# Altium schematic sheet POWER.SchDoc
size A4; SheetNumber: 4; SheetTotal: 4
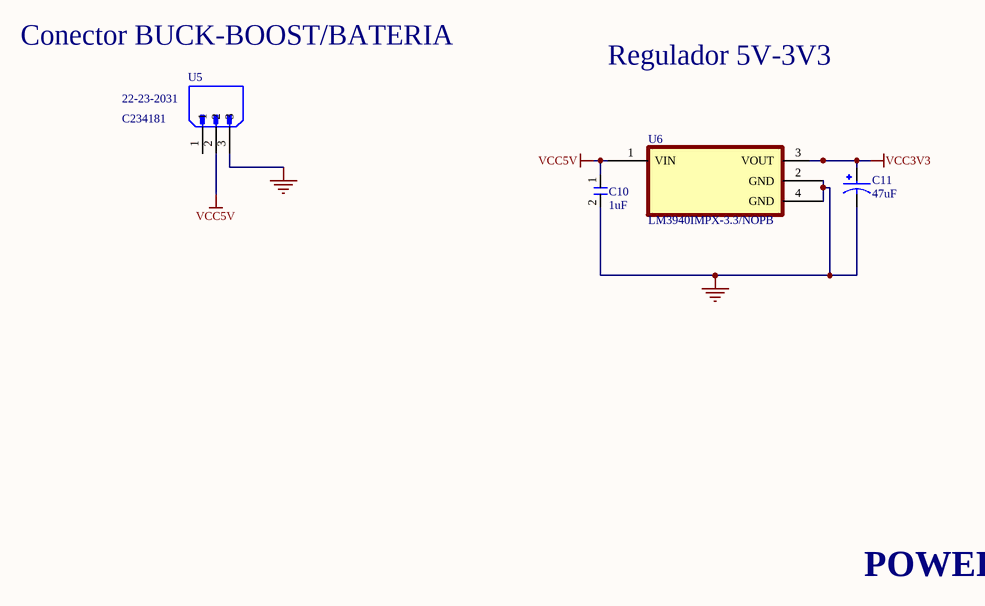
[diagram p0: POWER.SchDoc]

## Parts
C10  1uF  [0805_samsung]
C11  47uF  [47uF]
U5  22-23-2031  LCSC: C234181  [conector3pinos]
U6  LM3940IMPX-3.3/NOPB  [regulador]

## Nets
GND: C10.2 C11.2 U5.3 U6.2(GND) U6.4(GND)
VCC3V3: C11.1 U6.3(VOUT)
VCC5V: C10.1 U5.2 U6.1(VIN)

Not connected (* = marked no-connect by the designer): U5 1

## Notes on the sheet
- Conector BUCK-BOOST/BATERIA
- Regulador 5V-3V3
- POWER

## Library data of the parts
C10 = CL21B105KBFNNNE: 50V 1uF X7R ±10% 0805 Multilayer Ceramic Capacitors MLCC - SMD/SMT ROHS; Manufacturer: Samsung Electro-Mechanics; Value: 1µF; Supplier: Avnet; Supplier Part Number: CL21B105KBFNNNE; Manufacturer Part Number: CL21B105KBFNNNE; RoHS: Compliant; Category: Ceramic Capacitors; Stock: 488000; Pricing: 2000=0,00938, 4000=0,00922, 8000=0,00907, 16000=0,00892, 32000=0,00878 (USD); Case/Package: 0805; Case Code (Imperial): 0805; Case Code (Metric): 2012; China RoHS: Compliant; Depth: 1.25mm; Dielectric: X7R; Dielectric Material: Ceramic; Height: 1.35mm; Length: 2mm; Lifecycle Status: Production; Material: Ceramic; Max Operating Temperature: 125°C; Min Operating Temperature: -55°C; Mounting Technology: Surface Mount; Number of Terminals: 2; Radiation Hardening: No; REACH SVHC: Yes; Schedule B: 8532240020, 8532240020|8532240020, 8532240020|8532240020|8532240020, 8532240020|8532240020|8532240020|8532240020; Thickness: 1.3462mm; Tolerance: 10%; Voltage: 50V; Voltage Rating: 50V; Voltage Rating (DC): 50V; Width: 1.25mm; ComponentLink1URL: https://datasheet.octopart.com:443/CL21B105KBFNNNE-Samsung-Electro-Mechanics-datasheet-136482495.pdf?src-supplier=IHS; ComponentLink1Description: https://datasheet.octopart.com:443/CL21B105KBFNNNE-Samsung-Electro-Mechanics-datasheet-136482495.pdf?src-supplier=IHS; ComponentLink2URL: https://datasheet.octopart.com:443/CL21B105KBFNNNE-Samsung-Electro-Mechanics-datasheet-11733377.pdf?src-supplier=Future+Electronics; ComponentLink2Description: https://datasheet.octopart.com:443/CL21B105KBFNNNE-Samsung-Electro-Mechanics-datasheet-11733377.pdf?src-supplier=Future+Electronics; ComponentLink3URL: https://datasheet.octopart.com:443/CL21B105KBFNNNE-Samsung-Electro-Mechanics-datasheet-116891038.pdf?src-supplier=Future+Electronics; ComponentLink3Description: https://datasheet.octopart.com:443/CL21B105KBFNNNE-Samsung-Electro-Mechanics-datasheet-116891038.pdf?src-supplier=Future+Electronics; ComponentLink4URL: https://datasheet.octopart.com:443/CL21B105KBFNNNE-Samsung-Electro-Mechanics-datasheet-81462183.pdf?src-supplier=Future+Electronics; ComponentLink4Description: https://datasheet.octopart.com:443/CL21B105KBFNNNE-Samsung-Electro-Mechanics-datasheet-81462183.pdf?src-supplier=Future+Electronics; ComponentLink5URL: https://datasheet.octopart.com:443/CL21B105KBFNNNE-Samsung-datasheet-48647582.pdf?src-supplier=Future+Electronics; ComponentLink5Description: https://datasheet.octopart.com:443/CL21B105KBFNNNE-Samsung-datasheet-48647582.pdf?src-supplier=Future+Electronics; ComponentLink6URL: https://datasheet.octopart.com:443/CL21B105KBFNNNE-Samsung-datasheet-8326294.pdf?src-supplier=Future+Electronics; ComponentLink6Description: https://datasheet.octopart.com:443/CL21B105KBFNNNE-Samsung-datasheet-8326294.pdf?src-supplier=Future+Electronics; ComponentLink7URL: https://datasheet.octopart.com:443/CL21B105KBFNNNE-Samsung-Electro-Mechanics-datasheet-149045959.pdf?src-supplier=Future+Electronics; ComponentLink7Description: https://datasheet.octopart.com:443/CL21B105KBFNNNE-Samsung-Electro-Mechanics-datasheet-149045959.pdf?src-supplier=Future+Electronics; ComponentLink8URL: https://datasheet.octopart.com/CL21B105KBFNNNE-Samsung-Electro-Mechanics-datasheet-97040617.pdf; ComponentLink8Description: https://datasheet.octopart.com/CL21B105KBFNNNE-Samsung-Electro-Mechanics-datasheet-97040617.pdf; ComponentLink9URL: https://datasheet.octopart.com/CL21B105KBFNNNE-Samsung-Electro-Mechanics-datasheet-8324245.pdf; ComponentLink9Description: https://datasheet.octopart.com/CL21B105KBFNNNE-Samsung-Electro-Mechanics-datasheet-8324245.pdf; ComponentLink10URL: https://datasheet.octopart.com:443/CL21B105KBFNNNE-Samsung-datasheet-59220082.pdf?src-supplier=TME; ComponentLink10Description: https://datasheet.octopart.com:443/CL21B105KBFNNNE-Samsung-datasheet-59220082.pdf?src-supplier=TME
C11 = EEEFP1V470AP: Radial Can - SMD ALUMINUM ELECTROLYTIC CAPACITOR FP 35V 47muF ±20% 0.248Dia 6.30mm; Manufacturer: Panasonic; Manufacturer Lifecycle Status: ACTIVE; Part Series: FP (High temp. reflow); Value: 47µF; Dissipation Factor: 12%; ESR (Equivalent Series Resistance): 260mΩ; Leakage Current: 16.45µA; Life (Hours): 2000hours; Material: Aluminium; Ripple Current: 300mA; Supplier: Avnet; Supplier Part Number: EEE-FP1V470AP; Manufacturer Part Number: EEEFP1V470AP; RoHS: Compliant; Category: Aluminum Electrolytic Capacitors; Stock: 175000; Pricing: 1000=0,11738 (USD); Case/Package: Radial; China RoHS: Compliant; Contact Plating: Tin; Diameter: 6.3mm; Height: 5.8mm; Height - Seated (Max): 5.7912mm; Lead Free: Lead Free; Lead Pitch: 1.8mm; Length: 5.8mm; Lifecycle Status: Production; Max Operating Temperature: 105°C; Min Operating Temperature: -55°C; Mounting Technology: Surface Mount; Pins: 2; Number of Terminals: 2; Packaging: Cut Tape; Radiation Hardening: No; REACH SVHC: Yes; Ripple Current (AC): 300mA; Schedule B: 8532220020, 8532220020|8532220020|8532220020|8532220020|8532220020; Termination: SMD/SMT; Tolerance: 20%; Voltage: 35V; Voltage Rating: 35V; Voltage Rating (DC): 35V; Width: 6.6mm; ComponentLink1URL: https://datasheet.octopart.com:443/EEEFP1V470AP-Panasonic-datasheet-182100943.pdf?src-supplier=IHS; ComponentLink1Description: https://datasheet.octopart.com:443/EEEFP1V470AP-Panasonic-datasheet-182100943.pdf?src-supplier=IHS; ComponentLink2URL: https://datasheet.octopart.com:443/EEEFP1V470AP-Panasonic-datasheet-66433925.pdf?src-supplier=Future+Electronics; ComponentLink2Description: https://datasheet.octopart.com:443/EEEFP1V470AP-Panasonic-datasheet-66433925.pdf?src-supplier=Future+Electronics; ComponentLink3URL: https://datasheet.octopart.com:443/EEEFP1V470AP-Panasonic-datasheet-10533123.pdf?src-supplier=Future+Electronics; ComponentLink3Description: https://datasheet.octopart.com:443/EEEFP1V470AP-Panasonic-datasheet-10533123.pdf?src-supplier=Future+Electronics; ComponentLink4URL: https://datasheet.octopart.com:443/EEEFP1V470AP-Panasonic-datasheet-8835375.pdf?src-supplier=Future+Electronics; ComponentLink4Description: https://datasheet.octopart.com:443/EEEFP1V470AP-Panasonic-datasheet-8835375.pdf?src-supplier=Future+Electronics; ComponentLink5URL: https://datasheet.octopart.com:443/EEEFP1V470AP-Panasonic-datasheet-5402830.pdf?src-supplier=Future+Electronics; ComponentLink5Description: https://datasheet.octopart.com:443/EEEFP1V470AP-Panasonic-datasheet-5402830.pdf?src-supplier=Future+Electronics; ComponentLink6URL: https://datasheet.octopart.com:443/EEEFP1V470AP-Panasonic-datasheet-13268972.pdf?src-supplier=Electro+Sonic; ComponentLink6Description: https://datasheet.octopart.com:443/EEEFP1V470AP-Panasonic-datasheet-13268972.pdf?src-supplier=Electro+Sonic; ComponentLink7URL: https://datasheet.octopart.com:443/EEE-FP1V470AP-Panasonic-datasheet-27908621.pdf?src-supplier=Electro+Sonic; ComponentLink7Description: https://datasheet.octopart.com:443/EEE-FP1V470AP-Panasonic-datasheet-27908621.pdf?src-supplier=Electro+Sonic; ComponentLink8URL: https://datasheet.octopart.com:443/EEEFP1V470AP-Panasonic-datasheet-43765692.pdf?src-supplier=Newark; ComponentLink8Description: https://datasheet.octopart.com:443/EEEFP1V470AP-Panasonic-datasheet-43765692.pdf?src-supplier=Newark; ComponentLink9URL: https://datasheet.octopart.com:443/EEE-FP1V470AP-Panasonic-datasheet-166810424.pdf?src-supplier=Newark; ComponentLink9Description: https://datasheet.octopart.com:443/EEE-FP1V470AP-Panasonic-datasheet-166810424.pdf?src-supplier=Newark; ComponentLink10URL: https://datasheet.octopart.com:443/EEE-FP1V470AP-Panasonic-datasheet-154766120.pdf?src-supplier=Master+Electronics; ComponentLink10Description: https://datasheet.octopart.com:443/EEE-FP1V470AP-Panasonic-datasheet-154766120.pdf?src-supplier=Master+Electronics; ComponentLink11URL: https://sigma.octopart.com:443/150570760/technical_drawing/Panasonic-EEEFP1V470AP.pdf?src-supplier=Panasonic+SCT; ComponentLink11Description: https://sigma.octopart.com:443/150570760/technical_drawing/Panasonic-EEEFP1V470AP.pdf?src-supplier=Panasonic+SCT; ComponentLink12URL: https://datasheet.octopart.com:443/EEEFP1V470AP-Panasonic-datasheet-5301681.pdf?src-supplier=Farnell; ComponentLink12Description: https://datasheet.octopart.com:443/EEEFP1V470AP-Panasonic-datasheet-5301681.pdf?src-supplier=Farnell
U5 = 22-23-2031: KK 254 Solid Header, Vertical, with Friction Lock, 3 Circuits, Tin (Sn) Plating, Bag; Manufacturer: Molex; Manufacturer Lifecycle Status: ACTIVE; Approvals: CSA, UL; Contact Resistance: 10mΩ; Current Rating: 4A; Dielectric Material: Polyamide; Gender: Male; Glow Wire Compliant: Non-compliant; Insulation Resistance: 1GΩ; Number of Circuits: 2; Number of Contacts: 3; Number of Lines: 1; Operating Force: 4.8928N; Pitch: 2.54mm; Plating Thickness: 2.54µm; Voltage Rating: 500V; Voltage Rating (DC): 250V; Supplier: DigiKey; Supplier Part Number: WM4201-ND; Manufacturer Part Number: 22-23-2031; RoHS: Compliant; Category: Headers and Wire Housings; Stock: 60929; Pricing: 1=0,22, 10=0,189, 100=0,1608, 500=0,1435, 2000=0,13012, 6000=0,12041, 10000=0,11614 (USD); China RoHS: Compliant; Color: White; Contact Gender: Male; Contact Material: Brass; Contact Plating: Tin; Country of Origin: US; Depth: 6.35mm; Flammability Rating: UL94 V-0; Halogen Free: Low Halogen; Height: 10mm; Housing Color: White; Housing Material: Nylon; Lead Free: Lead Free; Lead Pitch: 2.54mm; Length: 10mm; Lifecycle Status: Production; Max Current Rating: 4A; Max Operating Temperature: 75°C; Min Operating Temperature: 0°C; Mounting Technology: Through Hole; Pins: 3; Number of Poles: 3; Number of Positions: 3; Number of Rows: 1; Orientation: Vertical; Packaging: Bulk; Radiation Hardening: No; REACH SVHC: Yes; Schedule B: 8536694040, 8536694040|8536694040|8536694040|8536694040|8536694040|8536694040|8536694040|8536694040|8536694040|8536694040|8536694040|8536694040|8536694040|8536694040|8536694040|8536694040|8536694040|8536694040|8536694040|8536694040|8536694040|8536694040|8536694040|85; Terminal Pitch: 2.54mm; Termination: Solder; Width: 10mm; ComponentLink1URL: https://sigma.octopart.com:443/153641738/technical_drawing/Molex-22232031.pdf?src-supplier=Sager+Electronics; ComponentLink1Description: https://sigma.octopart.com:443/153641738/technical_drawing/Molex-22232031.pdf?src-supplier=Sager+Electronics; ComponentLink2URL: https://datasheet.octopart.com:443/0022232031-Molex-datasheet-164461539.pdf?src-supplier=Sager+Electronics; ComponentLink2Description: https://datasheet.octopart.com:443/0022232031-Molex-datasheet-164461539.pdf?src-supplier=Sager+Electronics; ComponentLink3URL: https://datasheet.octopart.com:443/22-23-2031-Molex-datasheet-10979265.pdf?src-supplier=Upverter; ComponentLink3Description: https://datasheet.octopart.com:443/22-23-2031-Molex-datasheet-10979265.pdf?src-supplier=Upverter; ComponentLink4URL: https://datasheet.octopart.com:443/22-23-2031-Molex-datasheet-8803345.pdf?src-supplier=Upverter; ComponentLink4Description: https://datasheet.octopart.com:443/22-23-2031-Molex-datasheet-8803345.pdf?src-supplier=Upverter; ComponentLink5URL: https://datasheet.octopart.com:443/022232031-Molex-datasheet-8349839.pdf?src-supplier=Upverter; ComponentLink5Description: https://datasheet.octopart.com:443/022232031-Molex-datasheet-8349839.pdf?src-supplier=Upverter; ComponentLink6URL: https://datasheet.octopart.com:443/22-23-2031-Molex-datasheet-137053720.pdf?src-supplier=IHS; ComponentLink6Description: https://datasheet.octopart.com:443/22-23-2031-Molex-datasheet-137053720.pdf?src-supplier=IHS; ComponentLink7URL: https://datasheet.octopart.com:443/A-6373-03A222-Molex-datasheet-11014486.pdf?src-supplier=IHS; ComponentLink7Description: https://datasheet.octopart.com:443/A-6373-03A222-Molex-datasheet-11014486.pdf?src-supplier=IHS; ComponentLink8URL: https://datasheet.octopart.com:443/22-23-2031-Molex-datasheet-13784869.pdf?src-supplier=Molex; ComponentLink8Description: https://datasheet.octopart.com:443/22-23-2031-Molex-datasheet-13784869.pdf?src-supplier=Molex; ComponentLink9URL: https://sigma.octopart.com:443/16295904/technical_drawing/Molex-22-23-2031.pdf?src-supplier=Molex; ComponentLink9Description: https://sigma.octopart.com:443/16295904/technical_drawing/Molex-22-23-2031.pdf?src-supplier=Molex; ComponentLink10URL: https://datasheet.octopart.com:443/22-23-2031-Molex-datasheet-154747105.pdf?src-supplier=Master+Electronics; ComponentLink10Description: https://datasheet.octopart.com:443/22-23-2031-Molex-datasheet-154747105.pdf?src-supplier=Master+Electronics; ComponentLink11URL: https://datasheet.octopart.com:443/22-23-2031-Molex-datasheet-101581837.pdf?src-supplier=Farnell; ComponentLink11Description: https://datasheet.octopart.com:443/22-23-2031-Molex-datasheet-101581837.pdf?src-supplier=Farnell; ComponentLink12URL: https://datasheet.octopart.com:443/22-23-2031-Molex-datasheet-6994.pdf?src-supplier=Farnell; ComponentLink12Description: https://datasheet.octopart.com:443/22-23-2031-Molex-datasheet-6994.pdf?src-supplier=Farnell; ComponentLink13URL: https://datasheet.octopart.com:443/22-23-2031-Molex-datasheet-15766289.pdf?src-supplier=Farnell; ComponentLink13Description: https://datasheet.octopart.com:443/22-23-2031-Molex-datasheet-15766289.pdf?src-supplier=Farnell; ComponentLink14URL: https://datasheet.octopart.com:443/22-23-2031-Molex-datasheet-11538079.pdf?src-supplier=Farnell; ComponentLink14Description: https://datasheet.octopart.com:443/22-23-2031-Molex-datasheet-11538079.pdf?src-supplier=Farnell; ComponentLink15URL: https://datasheet.octopart.com:443/22-23-2031-Molex-datasheet-21538527.pdf?src-supplier=Electro+Sonic; ComponentLink15Description: https://datasheet.octopart.com:443/22-23-2031-Molex-datasheet-21538527.pdf?src-supplier=Electro+Sonic; ComponentLink16URL: https://datasheet.octopart.com:443/22-23-2031-Molex-datasheet-62103463.pdf?src-supplier=Electro+Sonic; ComponentLink16Description: https://datasheet.octopart.com:443/22-23-2031-Molex-datasheet-62103463.pdf?src-supplier=Electro+Sonic; ComponentLink17URL: https://datasheet.octopart.com:443/22-23-2031-Molex-datasheet-37168844.pdf?src-supplier=Electro+Sonic; ComponentLink17Description: https://datasheet.octopart.com:443/22-23-2031-Molex-datasheet-37168844.pdf?src-supplier=Electro+Sonic; ComponentLink18URL: https://datasheet.octopart.com:443/22-23-2031-Molex-datasheet-26579529.pdf?src-supplier=TME; ComponentLink18Description: https://datasheet.octopart.com:443/22-23-2031-Molex-datasheet-26579529.pdf?src-supplier=TME; ComponentLink19URL: https://datasheet.octopart.com:443/22-23-2031-Molex-datasheet-140181014.pdf?src-supplier=RS+(Formerly+Allied+Electronics); ComponentLink19Description: https://datasheet.octopart.com:443/22-23-2031-Molex-datasheet-140181014.pdf?src-supplier=RS+(Formerly+Allied+Electronics); ComponentLink20URL: https://datasheet.octopart.com:443/22-23-2031-Molex-datasheet-120145304.pdf?src-supplier=RS+(Formerly+Allied+Electronics); ComponentLink20Description: https://datasheet.octopart.com:443/22-23-2031-Molex-datasheet-120145304.pdf?src-supplier=RS+(Formerly+Allied+Electronics); ComponentLink21URL: https://datasheet.octopart.com:443/22-23-2031-Molex-datasheet-9904594.pdf?src-supplier=RS+(Formerly+Allied+Electronics); ComponentLink21Description: https://datasheet.octopart.com:443/22-23-2031-Molex-datasheet-9904594.pdf?src-supplier=RS+(Formerly+Allied+Electronics); ComponentLink22URL: https://datasheet.octopart.com:443/22-23-2031-Molex-datasheet-36197.pdf?src-supplier=RS+(Formerly+Allied+Electronics); ComponentLink22Description: https://datasheet.octopart.com:443/22-23-2031-Molex-datasheet-36197.pdf?src-supplier=RS+(Formerly+Allied+Electronics); ComponentLink23URL: https://datasheet.octopart.com:443/22232031-Molex-datasheet-137316104.pdf?src-supplier=Future+Electronics; ComponentLink23Description: https://datasheet.octopart.com:443/22232031-Molex-datasheet-137316104.pdf?src-supplier=Future+Electronics; ComponentLink24URL: https://datasheet.octopart.com:443/22-23-2031-Molex-datasheet-33002316.pdf?src-supplier=Newark; ComponentLink24Description: https://datasheet.octopart.com:443/22-23-2031-Molex-datasheet-33002316.pdf?src-supplier=Newark; ComponentLink25URL: https://datasheet.octopart.com:443/22-23-2031-Molex-datasheet-21206926.pdf?src-supplier=Newark; ComponentLink25Description: https://datasheet.octopart.com:443/22-23-2031-Molex-datasheet-21206926.pdf?src-supplier=Newark; ComponentLink26URL: https://datasheet.octopart.com:443/0022232031-Molex-datasheet-11893140.pdf?src-supplier=Arrow+Electronics; ComponentLink26Description: https://datasheet.octopart.com:443/0022232031-Molex-datasheet-11893140.pdf?src-supplier=Arrow+Electronics; ComponentLink27URL: https://datasheet.octopart.com:443/0022232031-Molex-datasheet-11631538.pdf?src-supplier=Arrow+Electronics; ComponentLink27Description: https://datasheet.octopart.com:443/0022232031-Molex-datasheet-11631538.pdf?src-supplier=Arrow+Electronics; ComponentLink28URL: https://datasheet.octopart.com:443/22-23-2031-Molex-datasheet-8399138.pdf?src-supplier=Verical; ComponentLink28Description: https://datasheet.octopart.com:443/22-23-2031-Molex-datasheet-8399138.pdf?src-supplier=Verical; ComponentLink29URL: https://datasheet.octopart.com:443/22-23-2031-Molex-datasheet-8339045.pdf?src-supplier=Verical; ComponentLink29Description: https://datasheet.octopart.com:443/22-23-2031-Molex-datasheet-8339045.pdf?src-supplier=Verical; ComponentLink30URL: https://datasheet.octopart.com:443/22232031-Molex-datasheet-7831523.pdf?src-supplier=Jameco; ComponentLink30Description: https://datasheet.octopart.com:443/22232031-Molex-datasheet-7831523.pdf?src-supplier=Jameco; ComponentLink31URL: https://datasheet.octopart.com:443/22-23-2031-Molex-datasheet-7276997.pdf?src-supplier=Jameco; ComponentLink31Description: https://datasheet.octopart.com:443/22-23-2031-Molex-datasheet-7276997.pdf?src-supplier=Jameco; ComponentLink32URL: https://datasheet.octopart.com:443/22-23-2031-Molex-datasheet-145352.pdf?src-supplier=DigiKey; ComponentLink32Description: https://datasheet.octopart.com:443/22-23-2031-Molex-datasheet-145352.pdf?src-supplier=DigiKey; ComponentLink33URL: http://sigma.octopart.com:80/16297233/rohs_statement/Molex-22-23-2031.pdf?src-supplier=Compliance+Statements; ComponentLink33Description: http://sigma.octopart.com:80/16297233/rohs_statement/Molex-22-23-2031.pdf?src-supplier=Compliance+Statements; ComponentLink34URL: http://sigma.octopart.com:80/conflict_mineral_statement/Molex-company-72.pdf?src-supplier=Compliance+Statements; ComponentLink34Description: http://sigma.octopart.com:80/conflict_mineral_statement/Molex-company-72.pdf?src-supplier=Compliance+Statements; ComponentLink35URL: http://sigma.octopart.com:80/rohs_statement/Molex-company-73.pdf?src-supplier=Compliance+Statements; ComponentLink35Description: http://sigma.octopart.com:80/rohs_statement/Molex-company-73.pdf?src-supplier=Compliance+Statements; ComponentLink36URL: http://sigma.octopart.com:80/reach_statement/Molex-company-74.pdf?src-supplier=Compliance+Statements; ComponentLink36Description: http://sigma.octopart.com:80/reach_statement/Molex-company-74.pdf?src-supplier=Compliance+Statements
U6 = LM3940IMPX-3.3/NOPB: 1-A, low-dropout voltage regulator for 5-V to 3.3-V conversion 4-SOT-223 -40 to 125; Manufacturer: Texas Instruments; Manufacturer Lifecycle Status: ACTIVE; Accuracy: 2.5%; Dropout Voltage: 500mV; Max Supply Voltage: 7.5V; Max Junction Temperature (Tj): 125°C; Max Output current: 1A; Min Input Voltage: 4.5V; Number of Channels: 1; Output Type: Fixed; Output Voltage: 3.3V; Polarity: Positive; Quiescent Current: 15mA; Supplier: Arrow Electronics; Supplier Part Number: LM3940IMPX-3.3/NOPB; Manufacturer Part Number: LM3940IMPX-3.3/NOPB; RoHS: Compliant; Category: LDO Voltage Regulators; Stock: 4000; Pricing: 2000=0,8378, 4000=0,805 (USD); Case/Package: SOT-223; Contact Plating: Tin; Height: 1.8mm; Lead Free: Lead Free; Length: 6.5mm; Lifecycle Status: Production; Max Operating Temperature: 125°C; Min Operating Temperature: -40°C; Min Supply Voltage: 4.5V; Mounting Technology: Surface Mount; Number of Outputs: 1; Pins: 4; Number of Regulators: 1; Output Current: 1A; Radiation Hardening: No; Schedule B: 8542390000, 8542390000|8542390000|8542390000|8542390000|8542390000; Thickness: 1.6mm; Width: 3.5mm; ComponentLink1URL: https://datasheet.octopart.com:443/LM3940IMPX-3.3-NOPB-Texas-Instruments-datasheet-37536452.pdf?src-supplier=Newark; ComponentLink1Description: https://datasheet.octopart.com:443/LM3940IMPX-3.3-NOPB-Texas-Instruments-datasheet-37536452.pdf?src-supplier=Newark; ComponentLink2URL: https://octopart.com:443/opatz8j6/c1?t=rvScTgIK7vzGzAkcs3Wrvb9UenW83nfYWqCYLRye1rllSdu9Beb0mrJ0jD3mxUE6L-G7r_WbA31oL6rbbcgGDwhvoCgJFhaPP2VcxwGiGkxkzw7jExuaO0qB7YjUEg7HO7wm7e8udALi6wjH3PcZfiOv8hqrGiPpD-c1dsCFFWiVgt4LsZWsN__Uwh1l8CkFPX6hFz62SNLgqesLCarricQSPLGZ_8-1w0Pi7AlFfsyeMSiSWLufX8N49_LiouBqoH5-Z8RZTzh6Rrh-S45GR5BvH6gVbYU3j4QdNB2550tcQlHMcE_JD-4k9aWhtYDm6rSzGkys3-qF4FGYb97CU4akCkkKKwscATKRo0mvSF3ub_RgSZQsh-CWTHPIweVGU4n0TA&src-supplier=Texas+Instruments; ComponentLink2Description: https://octopart.com:443/opatz8j6/c1?t=rvScTgIK7vzGzAkcs3Wrvb9UenW83nfYWqCYLRye1rllSdu9Beb0mrJ0jD3mxUE6L-G7r_WbA31oL6rbbcgGDwhvoCgJFhaPP2VcxwGiGkxkzw7jExuaO0qB7YjUEg7HO7wm7e8udALi6wjH3PcZfiOv8hqrGiPpD-c1dsCFFWiVgt4LsZWsN__Uwh1l8CkFPX6hFz62SNLgqesLCarricQSPLGZ_8-1w0Pi7AlFfsyeMSiSWLufX8N49_LiouBqoH5-Z8RZTzh6Rrh-S45GR5BvH6gVbYU3j4QdNB2550tcQlHMcE_JD-4k9aWhtYDm6rSzGkys3-qF4FGYb97CU4akCkkKKwscATKRo0mvSF3ub_RgSZQsh-CWTHPIweVGU4n0TA&src-supplier=Texas+Instruments; ComponentLink3URL: https://datasheet.octopart.com:443/LM3940IMPX-3.3-NOPB-Texas-Instruments-datasheet-32868818.pdf?src-supplier=Texas+Instruments; ComponentLink3Description: https://datasheet.octopart.com:443/LM3940IMPX-3.3-NOPB-Texas-Instruments-datasheet-32868818.pdf?src-supplier=Texas+Instruments; ComponentLink4URL: https://datasheet.octopart.com:443/LM3940IMPX-3.3-NOPB-Texas-Instruments-datasheet-14540343.pdf?src-supplier=Texas+Instruments; ComponentLink4Description: https://datasheet.octopart.com:443/LM3940IMPX-3.3-NOPB-Texas-Instruments-datasheet-14540343.pdf?src-supplier=Texas+Instruments; ComponentLink5URL: https://datasheet.octopart.com:443/LM3940IMPX-3.3/NOPB-Texas-Instruments-datasheet-12544179.pdf?src-supplier=Texas+Instruments; ComponentLink5Description: https://datasheet.octopart.com:443/LM3940IMPX-3.3/NOPB-Texas-Instruments-datasheet-12544179.pdf?src-supplier=Texas+Instruments; ComponentLink6URL: https://datasheet.octopart.com:443/LM3940IMPX-3.3/NOPB-Texas-Instruments-datasheet-10846469.pdf?src-supplier=Texas+Instruments; ComponentLink6Description: https://datasheet.octopart.com:443/LM3940IMPX-3.3/NOPB-Texas-Instruments-datasheet-10846469.pdf?src-supplier=Texas+Instruments; ComponentLink7URL: https://sigma.octopart.com:443/49253063/technical_drawing/Texas-Instruments-LM3940IMPX-3.3-NOPB.pdf?src-supplier=Texas+Instruments; ComponentLink7Description: https://sigma.octopart.com:443/49253063/technical_drawing/Texas-Instruments-LM3940IMPX-3.3-NOPB.pdf?src-supplier=Texas+Instruments; ComponentLink8URL: https://datasheet.octopart.com:443/LM3940IMPX-3.3-NOPB-Texas-Instruments-datasheet-159115208.pdf?src-supplier=Augswan; ComponentLink8Description: https://datasheet.octopart.com:443/LM3940IMPX-3.3-NOPB-Texas-Instruments-datasheet-159115208.pdf?src-supplier=Augswan; ComponentLink9URL: https://datasheet.octopart.com:443/LM3940IMPX-3.3-NOPB-Texas-Instruments-datasheet-62292511.pdf?src-supplier=Farnell; ComponentLink9Description: https://datasheet.octopart.com:443/LM3940IMPX-3.3-NOPB-Texas-Instruments-datasheet-62292511.pdf?src-supplier=Farnell; ComponentLink10URL: https://datasheet.octopart.com:443/LM3940IMPX-3.3-NOPB-Texas-Instruments-datasheet-68295779.pdf?src-supplier=Farnell; ComponentLink10Description: https://datasheet.octopart.com:443/LM3940IMPX-3.3-NOPB-Texas-Instruments-datasheet-68295779.pdf?src-supplier=Farnell; ComponentLink11URL: https://datasheet.octopart.com:443/LM3940IMPX-3.3-NOPB-Texas-Instruments-datasheet-165804071.pdf?src-supplier=LCSC; ComponentLink11Description: https://datasheet.octopart.com:443/LM3940IMPX-3.3-NOPB-Texas-Instruments-datasheet-165804071.pdf?src-supplier=LCSC; ComponentLink12URL: https://datasheet.octopart.com:443/LM3940IMPX-3.3-NOPB-Texas-Instruments-datasheet-137316104.pdf?src-supplier=Future+Electronics; ComponentLink12Description: https://datasheet.octopart.com:443/LM3940IMPX-3.3-NOPB-Texas-Instruments-datasheet-137316104.pdf?src-supplier=Future+Electronics; ComponentLink13URL: https://datasheet.octopart.com:443/LM3940IMPX-3.3/NOPB-National-Semiconductor-datasheet-128782.pdf?src-supplier=Future+Electronics; ComponentLink13Description: https://datasheet.octopart.com:443/LM3940IMPX-3.3/NOPB-National-Semiconductor-datasheet-128782.pdf?src-supplier=Future+Electronics; ComponentLink14URL: https://datasheet.octopart.com:443/LM3940IMPX-3.3-NOPB-Texas-Instruments-datasheet-8441755.pdf?src-supplier=Jameco; ComponentLink14Description: https://datasheet.octopart.com:443/LM3940IMPX-3.3-NOPB-Texas-Instruments-datasheet-8441755.pdf?src-supplier=Jameco; ComponentLink15URL: http://sigma.octopart.com:80/reach_statement/Texas-Instruments-company-64.pdf?src-supplier=Compliance+Statements; ComponentLink15Description: http://sigma.octopart.com:80/reach_statement/Texas-Instruments-company-64.pdf?src-supplier=Compliance+Statements; ComponentLink16URL: http://sigma.octopart.com:80/conflict_mineral_statement/Texas-Instruments-company-63.pdf?src-supplier=Compliance+Statements; ComponentLink16Description: http://sigma.octopart.com:80/conflict_mineral_statement/Texas-Instruments-company-63.pdf?src-supplier=Compliance+Statements